# Altium schematic sheet microcontroller.SchDoc
size A4; SheetNumber: 3; SheetTotal: 5
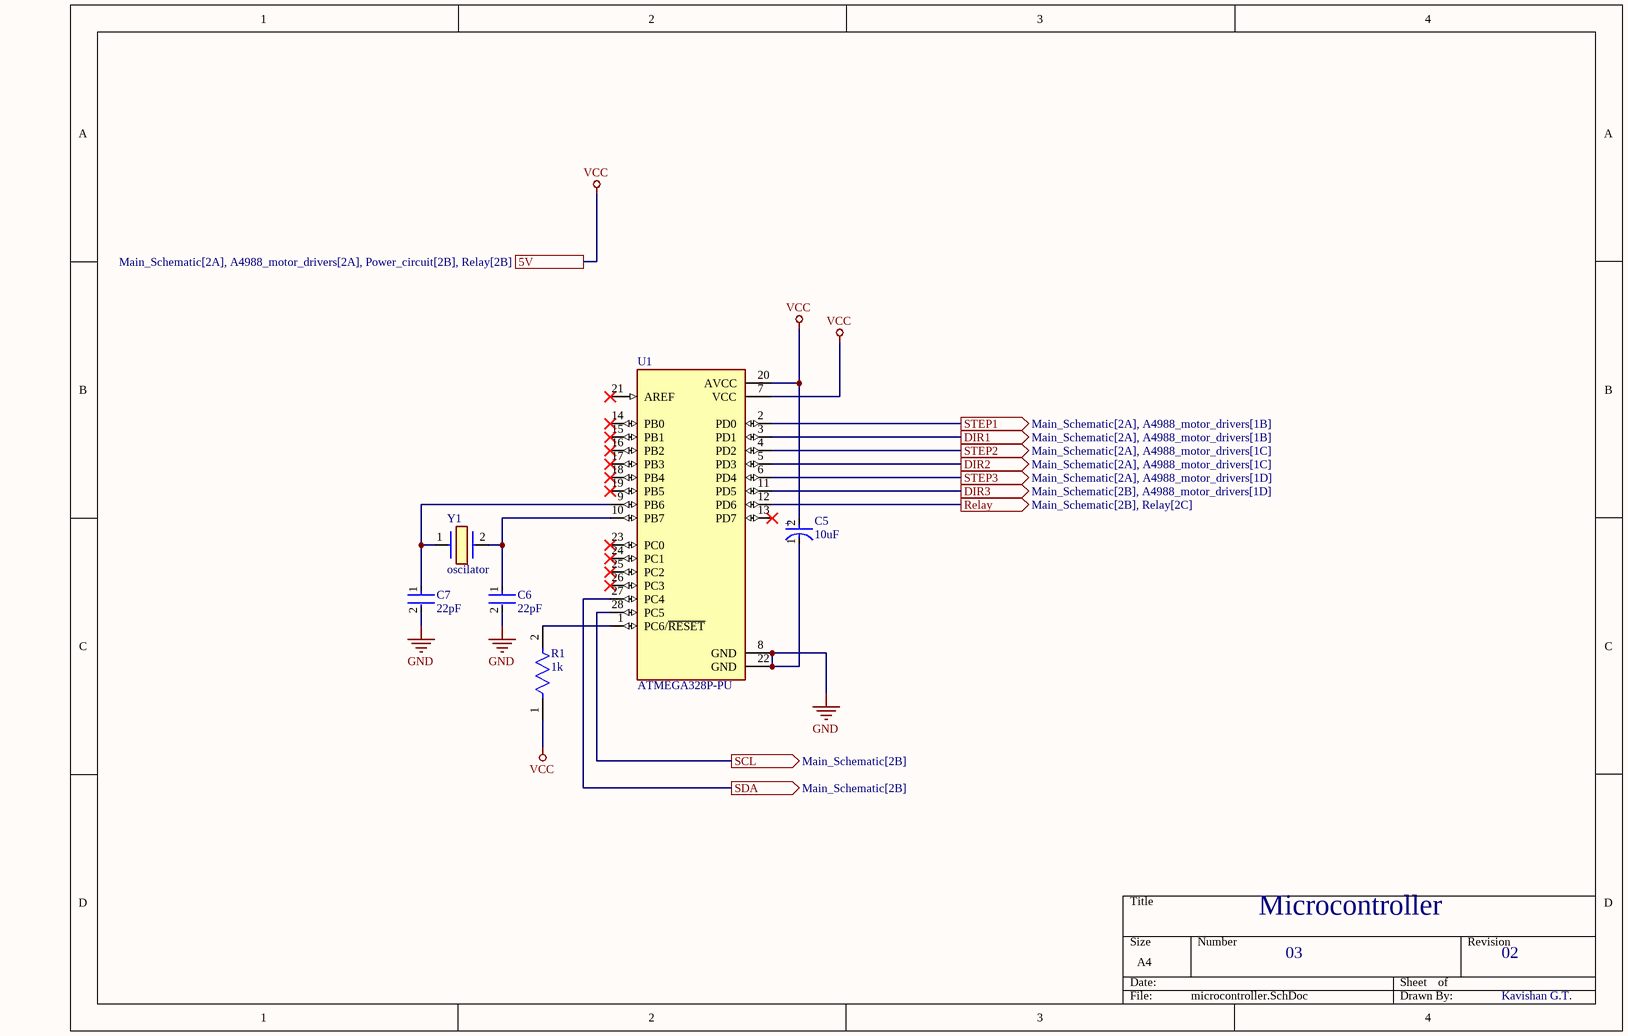
[diagram p0: microcontroller.SchDoc]

## Parts
C5  10uF  [FP-RAD-TH-D_12_5_0_5-L_20-MFG]
C6  22pF  [FP-RCE0K1-MFG]
C7  22pF  [FP-RCE0K1-MFG]
R1  1k  [FP-MFR-25-MFG]
U1  ATMEGA328P-PU  [DIP794W46P254L2967H457Q28B]
Y1  oscilator  [HC49USFF5F1816000MHZ]

## Ports
5V (see Main_Schematic[2A], A4988_motor_drivers[2A], Power_circuit[2B], Relay[2B]), DIR1 (out, see Main_Schematic[2A], A4988_motor_drivers[1B]), DIR2 (out, see Main_Schematic[2A], A4988_motor_drivers[1C]), DIR3 (out, see Main_Schematic[2B], A4988_motor_drivers[1D]), Relay (out, see Main_Schematic[2B], Relay[2C]), SCL (out, see Main_Schematic[2B]), SDA (out, see Main_Schematic[2B]), STEP1 (out, see Main_Schematic[2A], A4988_motor_drivers[1B]), STEP2 (out, see Main_Schematic[2A], A4988_motor_drivers[1C]), STEP3 (out, see Main_Schematic[2A], A4988_motor_drivers[1D])

## Nets
GND: C5.1(C) C6.2 C7.2 U1.8(GND) U1.22(GND)
VCC: C5.2(A) R1.1 U1.7(VCC) U1.20(AVCC) ; port 5V
DIR1: U1.3(PD1) ; port DIR1
DIR2: U1.5(PD3) ; port DIR2
DIR3: U1.11(PD5) ; port DIR3
Relay: U1.12(PD6) ; port Relay
SCL: U1.28(PC5) ; port SCL
SDA: U1.27(PC4) ; port SDA
STEP1: U1.2(PD0) ; port STEP1
STEP2: U1.4(PD2) ; port STEP2
STEP3: U1.6(PD4) ; port STEP3
NetC6_1: C6.1 U1.10(PB7) Y1.2
NetC7_1: C7.1 U1.9(PB6) Y1.1
NetR1_2: R1.2 U1.1(PC6/~{RESET})

Not connected (* = marked no-connect by the designer): U1 13(PD7)* 14(PB0)* 15(PB1)* 16(PB2)* 17(PB3)* 18(PB4)* 19(PB5)* 21(AREF)* 23(PC0)* 24(PC1)* 25(PC2)* 26(PC3)*

## Notes on the sheet
- Microcontroller
- 03
- 02
- Kavishan G.T.
- (in symbol CMP-05427-000861-1) +

## Library data of the parts
C5 = CMP-05427-000861-1: Aluminum Electrolytic Capacitors (Radial Lead Type) 10uF ±20% 450V; Polarity: Polar; Ripple Current (AC): 350mA; Life (Hours): 10000Hour; Lead Diameter: 0.6mm; Dielectric Material: Aluminium; Dissipation Factor: 0.24%; Voltage Rating: 450V; Lead Free: Lead Free; Capacitance: 10uF; Length: 20mm; Voltage Rating (DC): 450V; Packaging: Bulk; RoHS Compliant: Yes; Voltage: 450V; Height - Seated (Max): 0.787inch; Max Operating Temperature: 105°C; Lead Pitch: 5mm; Termination: Radial; Contact Plating: Tin; Mount: Through Hole; Diameter: 12.5mm; Number of Pins: 2; Min Operating Temperature: -25°C; Series: ED; Package Quantity: 200; Tolerance: 20%; REACH SVHC: No SVHC; Ripple Current: 350mA; Construction: RADIAL; Height: 20mm; Radiation Hardening: No; Case/Package: Radial
C6 C7 = CMP-06035-004895-1: Cap Ceramic 22pF 50V C0G ±5% Radial 5mm +125°C Automotive Bulk; Lead/Base Style: Formed Leads; Lead Diameter: 0.5mm; Max Operating Temperature: 125°C; Termination: Radial; Package Quantity: 2000; Capacitance: 22pF; Dielectric: C0G; Height - Seated (Max): 0.138inch; Width: 0.098inch; Lead Pitch: 0.197inch; Tolerance: 5%; Resistor Type: Ceramic; Case/Package: Radial; Mount: Through Hole; Voltage Rating: 50V; Ratings: AEC-Q200; Min Operating Temperature: -55°C; Packaging: Tape and Reel; Voltage Rating (DC): 50V; Height: 3.5mm; Length: 0.142inch
R1 = CMP-03413-000001-1: RES 1.18K OHM 1/4W 1% AXIAL; Manufacturer: Yageo; Manufacturer Part Number: MFR-25FBF52-1K18; Value: 1.18kΩ; Temperature Coefficient: 100ppm/°C; Power Rating: 0.25W; Voltage Rating: 250V; Temperature: -55°C to +155°C; Automotive: No; Temperature Range High: +155°C; Mouser Description: Metal Film Resistors 1.18K OHM 1/4W 1%; Digikey Description: RES 1.18K OHM 1/4W 1% AXIAL; Lead Free: Yes; Tolerance: 1%; ComponentLink2Description: Datasheet; ComponentLink2URL: https://www.yageo.com/upload/media/product/products/datasheet/lr/Yageo_LR_MFR_1.pdf; Temperature Range Low: -55°C; Package: MFR-25; Ipc Land Pattern Name: RESAD1000W75L680D260; Composition: Metal Film; Category: Res; Octopart: https://octopart.com/mfr-25fbf52-1k18-yageo-56251681; Series: MFR; Device Class L2: Resistors; Height: 2.6mm; Resistance: 1.18kΩ; Device Class L3: Through-Hole Resistors; RoHS: TRUE; Device Class L1: Passive Components
U1 = ATMEGA328P-PU: ATmega Series 20 MHz 32 KB Flash 2 KB SRAM 8-Bit Microcontroller - DIP-28; MP: ATMEGA328P-PU; Package: None; Availability: Unavailable; Price: None; Value: *
Y1 = HC49US-FF5F18-16.000MHZ: Crystal or Oscillator; Manufacturer_Name: ILSI AMERICA; Datasheet Link: https://abracon.com/datasheets/ILSI/HC49US.pdf; Height: 3.5mm; Manufacturer_Part_Number: HC49US-FF5F18-16.000MHZ